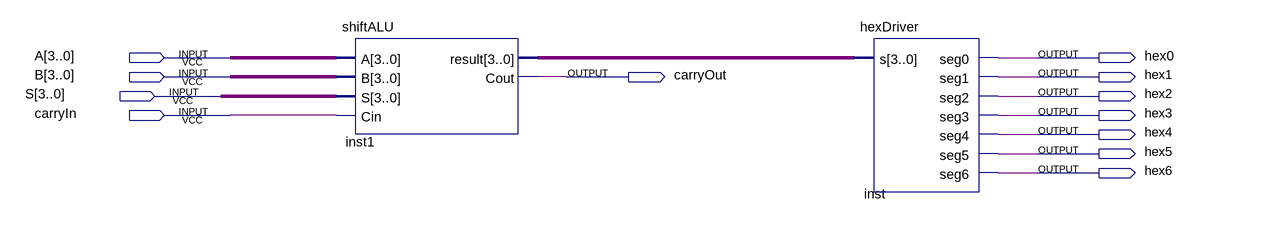
[diagram p0: schematic sheet]
// Quartus schematic top.bdf as structural Verilog: 2 symbols, 12 pins
module top (
  input  [3:0] A,
  input  [3:0] B,
  input  [3:0] S,
  input  carryIn,
  output hex0,
  output carryOut,
  output hex1,
  output hex2,
  output hex3,
  output hex4,
  output hex5,
  output hex6
);

  wire [3:0] inst1_result;

  shiftALU inst1 (.A(A), .B(B), .S(S), .Cin(carryIn), .result(inst1_result), .Cout(carryOut));
  hexDriver inst (
    .s(inst1_result), .seg0(hex0), .seg1(hex1), .seg2(hex2), .seg3(hex3), .seg4(hex4), .seg5(hex5),
    .seg6(hex6));
endmodule
